# EAGLE design LB_i3_Button-v03(rev2) (EAGLE 6.6.0)
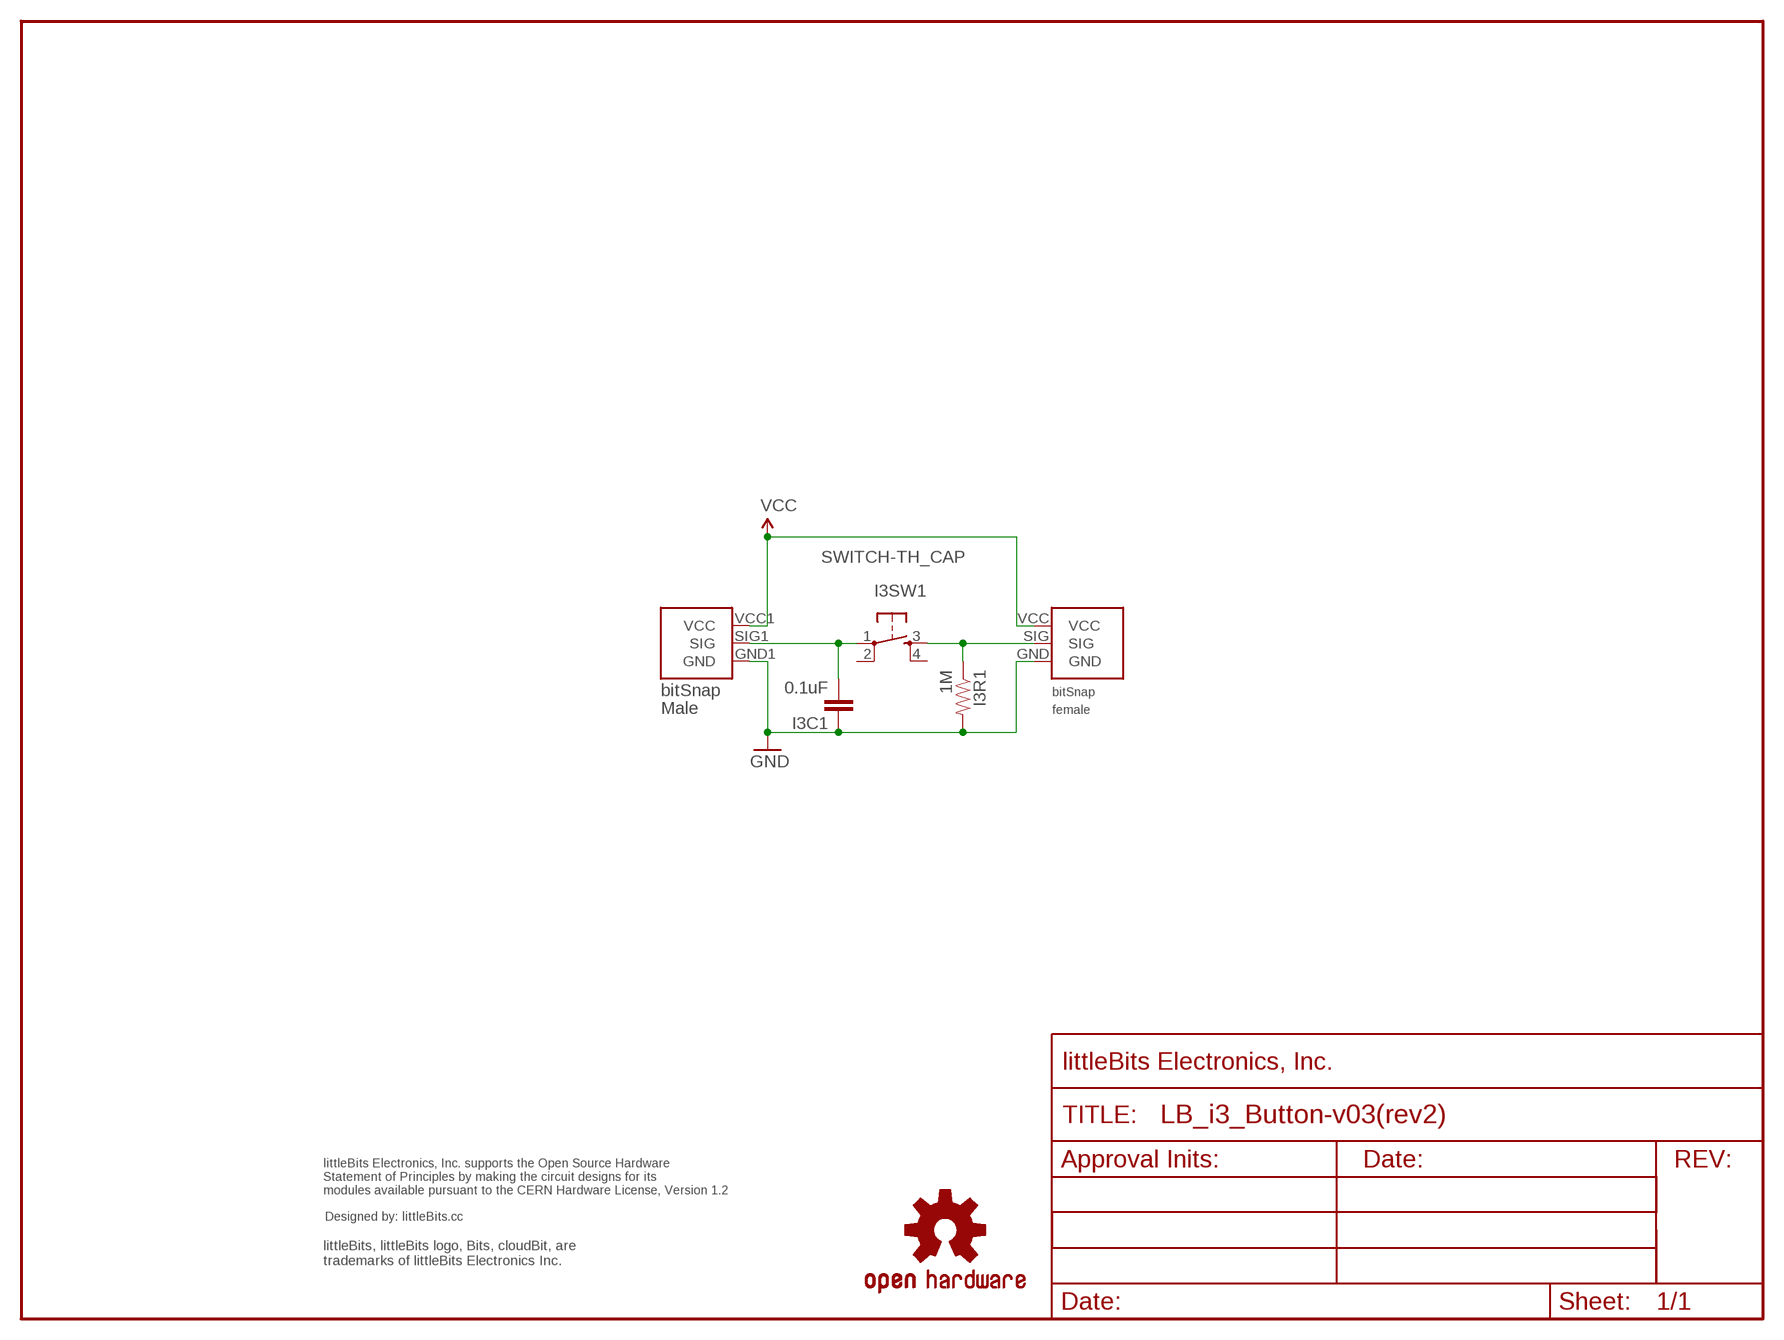
[diagram p0: schematic, sheet 1]

## Parts
I3BSF1  BITSNAP_V03_FEMALE  [BITSNAP_V03_FEMALE]
I3BSM1  BITSNAP_V03_MALE  [BITSNAP_V03_MALE]
I3C1  0.1uF  CAP0603-CAP  [0603-CAP]
I3R1  1M  RESISTOR0603-RES  [0603-RES]
I3SW1  SWITCH-TH_CAP  [SWITCH-TH_CAP]
U$1  OSHW-LOGOL  [OSHW-LOGO-L]
U$2  FRAME-LETTER-OHWOHW  [FABDWG01-OHW]
U$5  LB_CREDITS  [OSHWCREDIT]

## Nets
GND: I3BSF1.GND I3BSM1.GND1(GND) I3C1.1 I3R1.2
SIG: I3BSM1.SIG1(SIG) I3C1.2 I3SW1.1
SIG2: I3BSF1.SIG I3R1.1 I3SW1.3
VCC: I3BSF1.VCC I3BSM1.VCC1(VCC)
Unconnected: I3SW1.2 I3SW1.4

## Library data of the parts
I3BSF1 = bitSnap:BITSNAP_V03_FEMALE
I3BSM1 = bitSnap:BITSNAP_V03_MALE
I3C1 = SparkFun:CAP: Capacitor Standard 0603 ceramic capacitor, and 0.1" leaded capacitor.
I3R1 = SparkFun:RESISTOR: Resistor Basic schematic elements and footprints for 0603, 1206, and PTH 1/10th watt (small) resistors.
I3SW1 = LITTLEBITS:SWITCH-TH_CAP
U$1 = SparkFun:OSHW-LOGO: Open Source Hardware Logo This logo indicates the piece of hardware it is found on incorporates a OSHW license and/or adheres to the definition of open source hardware found here: http://freedomdefined.org/OSHW
U$2 = LITTLEBITS:FRAME-LETTER-OHW
U$5 = LITTLEBITS:LB_CREDITS

## Board
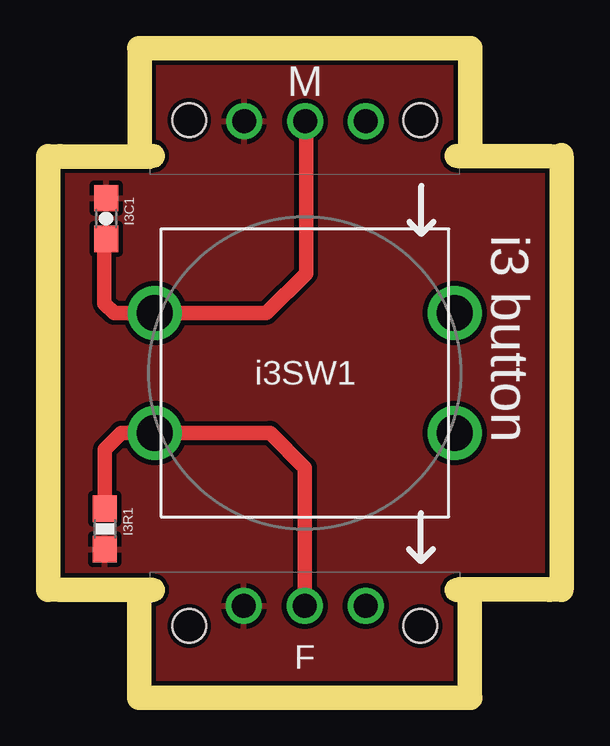
[diagram p1: board, top side]
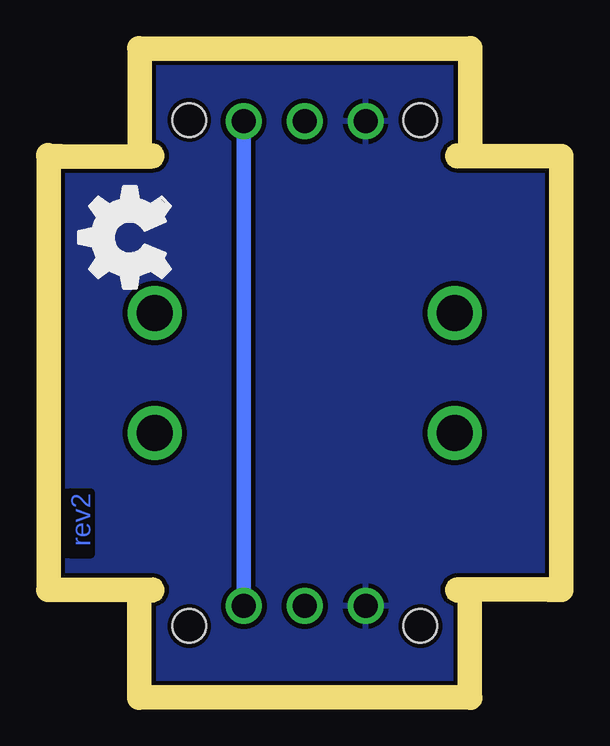
[diagram p2: board, bottom side, seen from below]

Size 20.4 x 26.1 mm. Coordinates in mm from the lower left corner, seen from the top.
Outline: 0,4.5 0,21.6
Outline: 20.4,21.6 20.4,4.5
Copper layers (1*16): Top 0.035mm / dielectric 1.5mm / Bottom 0.035mm
Design rules "default": minimum track width 0.2mm, minimum drill 0.4mm, track to track 0.2mm, track to pad 0.2mm, pad to pad 0.2mm, via to via 0.2mm, smd to smd 0mil, copper to edge 0.2mm, drill to drill 0.2mm, minimum pad ring 0.2mm, minimum via ring 0.15mm, stop-mask expansion 0.1mm, vias tented up to drill 0mil, thermal gap 0.2mm
Milling: 7 lines

### Footprints (pad centres in the part's own frame; a part is rotated, then mirrored left to right if it is on the bottom)
BITSNAP_V03_FEMALE = drill 1: GND 3.91,3.33; SIG 6.45,3.33; VCC 8.99,3.33 | hole 1.4: 1.63,2.5; 11.27,2.5
BITSNAP_V03_MALE = drill 1: GND1 8.98,2.56; SIG1 6.44,2.56; VCC1 3.9,2.56 | hole 1.4: 11.27,2.5; 1.63,2.5
0603-CAP = smd 1.1 x 1: 1 -0.85,0; 2 0.85,0
0603-RES = smd 1.1 x 1: 1 -0.85,0; 2 0.85,0
SWITCH-TH_CAP = drill 1.5: 1 -0.25,8.5; 2 12.25,8.5; 3 -0.25,3.5; 4 12.25,3.5

### Placement (x,y rotation side)
I3BSF1  3.75,0 0 top
I3BSM1  16.65,26.1 180 top
I3C1  1.92,19.49 270 top
I3R1  1.87,6.55 270 top
I3SW1  4.2,7.05 0 top
U$1  -14.19,-14.29 0 top  (outside the outline)
U$2  0,0 0 top
U$3  [OSHW_FILLX150_NOTEXT]  15.81,15.75 0 top
U$5  -6.18,-18.78 0 top  (outside the outline)

### Tracks (layer width: path | path; a pad name or v marks a point on that pad's centre or on a via)
GND
  pour Top: 0.15,0.15 0.2,25.86 20.22,25.91 20.22,0.15
  pour Bottom: 0.15,0.15 0.2,25.9 20.2,25.9 20.25,0.15
SIG
  Top 0.61: I3BSM1.SIG1 10.25,23.1 10.25,17.2 8.6,15.55 I3SW1.1 2.25,15.55 1.85,15.95 1.85,18.57 I3C1.2
SIG2
  Top 0.61: I3BSF1.SIG 10.2,9.1 8.75,10.55 I3SW1.3 2.55,10.55 1.87,9.87 I3R1.1
VCC
  Bottom 0.61: I3BSF1.VCC 12.75,5.95 | 12.75,5.95 I3BSM1.VCC1 | 12.75,5.75 12.75,5.95

### Text on the board
Bottom: rev2
tPlace: i3 button
tNames: i3SW1
Reference: MEDIUM